# Altium schematic sheet 海关全向控制器主控板电路V2_主控芯片.SchDoc
size A4
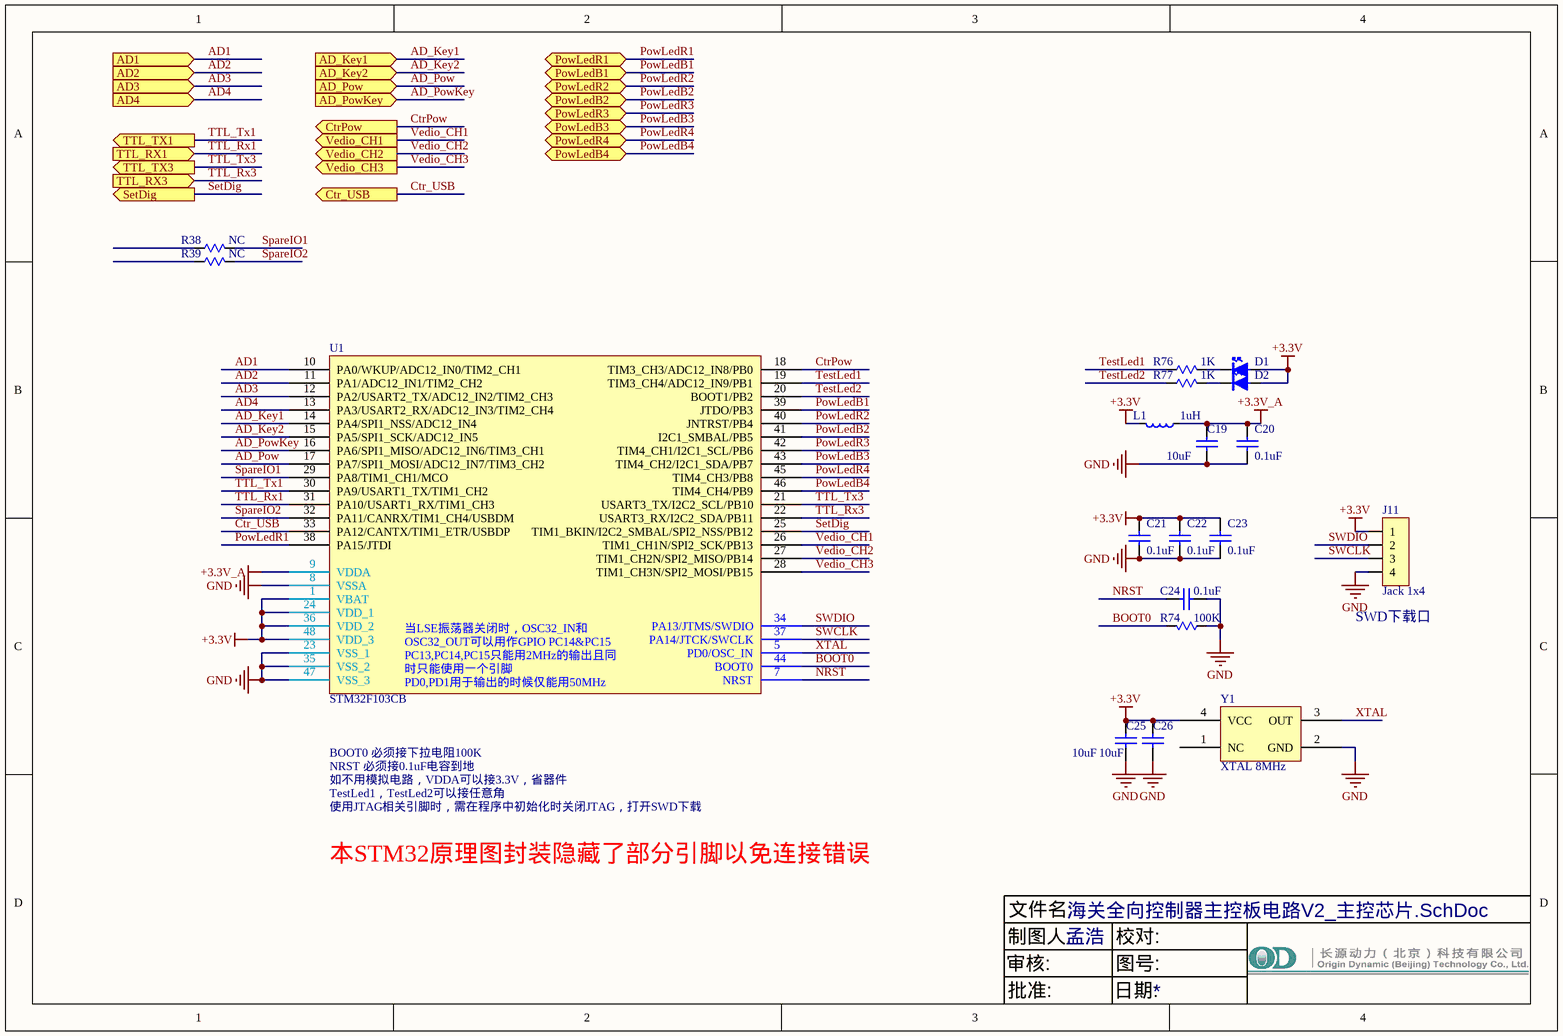
[diagram p0: 海关全向控制器主控板电路V2_主控芯片.SchDoc]

## Parts
C19  10uF  [C0603]
C20  0.1uF  [C0603]
C21  0.1uF  [C0603]
C22  0.1uF  [C0603]
C23  0.1uF  [C0603]
C24  0.1uF  [C0603]
C25  10uF  [C0603]
C26  10uF  [C0603]
D1  LED  [LED0603]  (value not drawn)
D2  LED  [LED0603]  (value not drawn)
J11  Jack 1x4  [Jk1*4-2.0]
L1  1uH  [L0603]
R38  NC  [R0603]
R39  NC  [R0603]
R74  100K  [R0603]
R76  1K  [R0603]
R77  1K  [R0603]
U1  STM32F103CB  [LQF48]
Y1  XTAL 8MHz  [XTAL5032]

## Ports
AD1 (in), AD2 (in), AD3 (in), AD4 (in), AD_Key1 (in), AD_Key2 (in), AD_Pow (in), AD_PowKey (in), Ctr_USB (out), CtrPow (out), PowLedB1 (bidir), PowLedB2 (bidir), PowLedB3 (bidir), PowLedB4 (bidir), PowLedR1 (bidir), PowLedR2 (bidir), PowLedR3 (bidir), PowLedR4 (bidir), SetDig (out), TTL_RX1 (in), TTL_RX3 (in), TTL_TX1 (out), TTL_TX3 (out), Vedio_CH1 (out), Vedio_CH2 (out), Vedio_CH3 (out)

## Nets
+3.3V: C21.1 C22.1 C23.1 C25.2 C26.2 D1.1(A) D2.1(A) J11.1 L1.1 U1.1(VBAT) U1.24(VDD_1) U1.36(VDD_2) U1.48(VDD_3) Y1.4(VCC)
+3.3V_A: C19.2 C20.1 L1.2 U1.9(VDDA)
GND: C19.1 C20.2 C21.2 C22.2 C23.2 C24.2 C25.1 C26.1 J11.4 R74.1 U1.8(VSSA) U1.23(VSS_1) U1.35(VSS_2) U1.47(VSS_3) Y1.2(GND)
AD1: U1.10(PA0/WKUP/ADC12_IN0/TIM2_CH1) ; port AD1
AD2: U1.11(PA1/ADC12_IN1/TIM2_CH2) ; port AD2
AD3: U1.12(PA2/USART2_TX/ADC12_IN2/TIM2_CH3) ; port AD3
AD4: U1.13(PA3/USART2_RX/ADC12_IN3/TIM2_CH4) ; port AD4
AD_Key1: U1.14(PA4/SPI1_NSS/ADC12_IN4) ; port AD_Key1
AD_Key2: U1.15(PA5/SPI1_SCK/ADC12_IN5) ; port AD_Key2
AD_Pow: U1.17(PA7/SPI1_MOSI/ADC12_IN7/TIM3_CH2) ; port AD_Pow
AD_PowKey: U1.16(PA6/SPI1_MISO/ADC12_IN6/TIM3_CH1) ; port AD_PowKey
BOOT0: R74.2 U1.44(BOOT0)
Ctr_USB: U1.33(PA12/CANTX/TIM1_ETR/USBDP) ; port Ctr_USB
CtrPow: U1.18(TIM3_CH3/ADC12_IN8/PB0) ; port CtrPow
NRST: C24.1 U1.7(NRST)
PowLedB1: U1.39(JTDO/PB3) ; port PowLedB1
PowLedB2: U1.41(I2C1_SMBAL/PB5) ; port PowLedB2
PowLedB3: U1.43(TIM4_CH2/I2C1_SDA/PB7) ; port PowLedB3
PowLedB4: U1.46(TIM4_CH4/PB9) ; port PowLedB4
PowLedR1: U1.38(PA15/JTDI) ; port PowLedR1
PowLedR2: U1.40(JNTRST/PB4) ; port PowLedR2
PowLedR3: U1.42(TIM4_CH1/I2C1_SCL/PB6) ; port PowLedR3
PowLedR4: U1.45(TIM4_CH3/PB8) ; port PowLedR4
SetDig: U1.25(TIM1_BKIN/I2C2_SMBAL/SPI2_NSS/PB12) ; port SetDig
SpareIO1: R38.2 U1.29(PA8/TIM1_CH1/MCO)
SpareIO2: R39.2 U1.32(PA11/CANRX/TIM1_CH4/USBDM)
SWCLK: J11.3 U1.37(PA14/JTCK/SWCLK)
SWDIO: J11.2 U1.34(PA13/JTMS/SWDIO)
TestLed1: R76.1 U1.19(TIM3_CH4/ADC12_IN9/PB1)
TestLed2: R77.1 U1.20(BOOT1/PB2)
TTL_Rx1: U1.31(PA10/USART1_RX/TIM1_CH3) ; port TTL_RX1
TTL_Rx3: U1.22(USART3_RX/I2C2_SDA/PB11) ; port TTL_RX3
TTL_Tx1: U1.30(PA9/USART1_TX/TIM1_CH2) ; port TTL_TX1
TTL_Tx3: U1.21(USART3_TX/I2C2_SCL/PB10) ; port TTL_TX3
Vedio_CH1: U1.26(TIM1_CH1N/SPI2_SCK/PB13) ; port Vedio_CH1
Vedio_CH2: U1.27(TIM1_CH2N/SPI2_MISO/PB14) ; port Vedio_CH2
Vedio_CH3: U1.28(TIM1_CH3N/SPI2_MOSI/PB15) ; port Vedio_CH3
XTAL: U1.5(PD0/OSC_IN) Y1.3(OUT)
NetD1_2: D1.2(K) R76.2
NetD2_2: D2.2(K) R77.2

Not connected (* = marked no-connect by the designer): R38 1; R39 1; U1 2(PC13-TAMPER-RTC) 3(PC14-OSC32_IN) 4(PC15-OSC32_OUT) 6(PD1/OSC_OUT); Y1 1(NC)

## Notes on the sheet
- (near J11) SWD下载口
- BOOT0 必须接下拉电阻100K
- NRST 必须接0.1uF电容到地
- 如不用模拟电路，VDDA可以接3.3V，省器件
- TestLed1，TestLed2可以接任意角
- 使用JTAG相关引脚时，需在程序中初始化时关闭JTAG，打开SWD下载
- 本STM32原理图封装隐藏了部分引脚以免连接错误
- 文件名:
- 审核:
- 制图人:
- 孟浩
- 校对:
- 图号:
- 批准:
- 日期:
- (in symbol STM32F103Cx) OSC32_IN和OSC32_OUT可以用作通用IO PC14和PC15; PC13,PC14,PC15只能用于2MHz的输出模式且同时只能使用一个引脚; 当LSE振荡器关闭时，OSC32_IN和OSC32_OUT可以用作GPIO PC14&PC15 / PC13,PC14,PC15只能用2MHz的输出且同时只能使用一个引脚 / PD0,PD1用于输出的时候仅能用50MHz

## Library data of the parts
C19-C26 = Cap: Capacitor; Published: 8-Jun-2000; Publisher: Altium Limited
  C19 C25 C26: LatestRevisionDate: 17-Jul-2002; LatestRevisionNote: Re-released for DXP Platform.; PackageReference: RAD-0.3; Value: 10uF
  C20-C24: Revision: July-2002: Re-released for DXP Platform.; Value: 0.1uF
J11 = Jack 1x4: 插座
L1 = INDUCTOR: Code_IEC: 1005; Published: 8-Jun-2000; LatestRevisionDate: 17-Jul-2002; LatestRevisionNote: Re-released for DXP Platform.; PackageReference: 0402-A; Publisher: Altium Limited; Code_JEITA: 0402; Value: 1uH
R38 R39 = Res: Resistor; Value: 1K; Published: 8-Jun-2000; LatestRevisionDate: 04-Mar-2005; LatestRevisionNote: PCB Footprint replaced.; PackageReference: J1-0603; Publisher: Altium Limited
R74 = RES: Resistor; Published: 8-Jun-2000; LatestRevisionDate: 17-Jul-2002; LatestRevisionNote: Re-released for DXP Platform.; PackageReference: AXIAL-0.3; Publisher: Altium Limited; Value: 100K
R76 R77 = Res: Resistor; Published: 8-Jun-2000; LatestRevisionDate: 04-Mar-2005; LatestRevisionNote: PCB Footprint replaced.; PackageReference: J1-0603; Publisher: Altium Limited; Value: 1K
U1 = STM32F103Cx
Y1 = XTAL